# Altium schematic sheet SCH.SchDoc
size A4
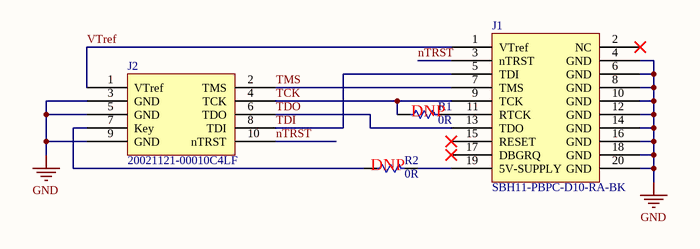
[diagram p0: SCH.SchDoc]

## Parts
J1  SBH11-PBPC-D10-RA-BK  [20PIN_2.54]
J2  20021121-00010C4LF  [10PIN_1.27]
R1  0R  [R0402]
R2  0R  [R0402]

## Nets
GND: J1.4(GND) J1.6(GND) J1.8(GND) J1.10(GND) J1.12(GND) J1.14(GND) J1.16(GND) J1.18(GND) J1.20(GND) J2.3(GND) J2.5(GND) J2.9(GND)
nTRST: J1.3(nTRST) J2.10(nTRST)
TCK: J1.9(TCK) J2.4(TCK) R1.1
TDI: J1.5(TDI) J2.8(TDI)
TDO: J1.13(TDO) J2.6(TDO)
TMS: J1.7(TMS) J2.2(TMS)
VTref: J1.1(VTref) J2.1(VTref)
NetJ1_11: J1.11(RTCK) R1.2
NetJ1_19: J1.19(5V-SUPPLY) R2.2
NetJ2_7: J2.7(Key) R2.1

Not connected (* = marked no-connect by the designer): J1 2(NC)* 15(RESET)* 17(DBGRQ)*

## Notes on the sheet
- (near R2) DNP
- (near R1) DNP

## Library data of the parts
J1 = SBH11-PBPC-D10-RA-BK: CONN HEADR 2.54MM 20POS GOLD R/A; Manufacturer: Sullins; Number of Positions: 20; Connector Type: Male Pin; Pitch: 0.1inch; Supplier 1: Digi-Key; Manufacturer Part Number: SBH11-PBPC-D10-RA-BK; Stock 1: 4652; Pricing 1: 1=0.83, 10=0.732, 100=0.6316, 500=0.5168, 1000=0.4594, 5000=0.4147 (USD); Mount: Through Hole; Color: Black; Contact Plating: Gold; Package Quantity: 1; Number of Rows: 2; Packaging: Tray; Termination: Solder; Row Spacing: 0.1inch; Lead Free: Lead Free; Supplier Part Number 1: S9180-ND
J2 = 20021121-00010C4LF: 10 Positions Header, Unshrouded Connector 0.050" (1.27mm) Surface Mount Gold; Manufacturer: Amphenol FCI; Contact Resistance: 30mR; Current Rating: 1A; Voltage Rating: 125V; Number of Positions: 10; Insulation Resistance: 100MR; Gender: Male; Connector Type: Header,Male Pin; Row Spacing: 0.05inch; Stack Height: 3mm; Mating Post Length: 3.05mm; Supplier 1: Digi-Key; Manufacturer Part Number: 20021121-00010C4LF; Stock 1: 84330; Pricing 1: 1=0.9, 10=0.797, 100=0.6951 (USD); Mount: Surface Mount; Contact Plating: Gold; Contact Material: Copper,Copper Alloy,Gold; Color: Black; Housing Material: Thermoplastic; Housing Color: Black; Min Operating Temperature: -40°C; Max Operating Temperature: 85°C; Number of Rows: 2; Packaging: Tape and Reel; Package Quantity: 600; Termination: Solder; Max Voltage Rating (AC): 125V; Number of Contacts: 10; Orientation: Straight; Length: 6.35mm; Pitch: 1.27mm; Depth: 3.4mm; Contact Mating Length: 0.12inch; Radiation Hardening: No; REACH SVHC: No SVHC; ComponentLink1URL: https://www.verical.com/server-webapp/html/getDatasheet?partID=177140; ComponentLink1Description: https://www.verical.com/server-webapp/html/getDatasheet?partID=177140; ComponentLink2URL: http://portal.fciconnect.com/Comergent/fci/drawing/20021121.pdf; ComponentLink2Description: http://portal.fciconnect.com/Comergent/fci/drawing/20021121.pdf; ComponentLink3URL: https://media.digikey.com/pdf/Data%20Sheets/FCI%20PDFs/Minitek%20127_Catalog.pdf; ComponentLink3Description: https://media.digikey.com/pdf/Data%20Sheets/FCI%20PDFs/Minitek%20127_Catalog.pdf; ComponentLink4URL: http://portal.fciconnect.com/Comergent//fci/drawing/20021121.pdf; ComponentLink4Description: http://portal.fciconnect.com/Comergent//fci/drawing/20021121.pdf; Supplier Part Number 1: 609-3695-1-ND
R1 R2 = RC0402JR-070RL: RES SMD 0 OHM 1/16W 0402; Manufacturer: Yageo; Resistance: 0mR; Power Rating: 62.5mW; Tolerance: 5%; Voltage Rating: 50V; Max Power Dissipation: 63mW; Temperature Coefficient: 200ppm/°C; Supplier 1: Digi-Key; Manufacturer Part Number: RC0402JR-070RL; Stock 1: 44333412; Pricing 1: 1=0.1, 10=0.017, 25=0.0124, 50=0.0096, 100=0.007, 250=0.0054, 500=0.0043, 1000=0.0032, 5000=0.0023 (USD); Case/Package: 0402; Contact Plating: Matte,Tin; Case Code (Metric): 1005; Case Code (Imperial): 0402; Min Operating Temperature: -55°C; Max Operating Temperature: 155°C; Packaging: Tape and Reel; Composition: Thick Film; Package Quantity: 1; Number of Terminations: 2; Termination: SMD/SMT; Military Standard: Not; Features: Moisture Resistant; Length: 1mm; Height: 0.016inch; Width: 0.02inch; Depth: 0.5mm; Radiation Hardening: No; REACH SVHC: Unknown; Lead Free: Lead Free; Supplier Part Number 1: 311-0.0JRCT-ND